# Altium schematic sheet encoder.SchDoc
size A4
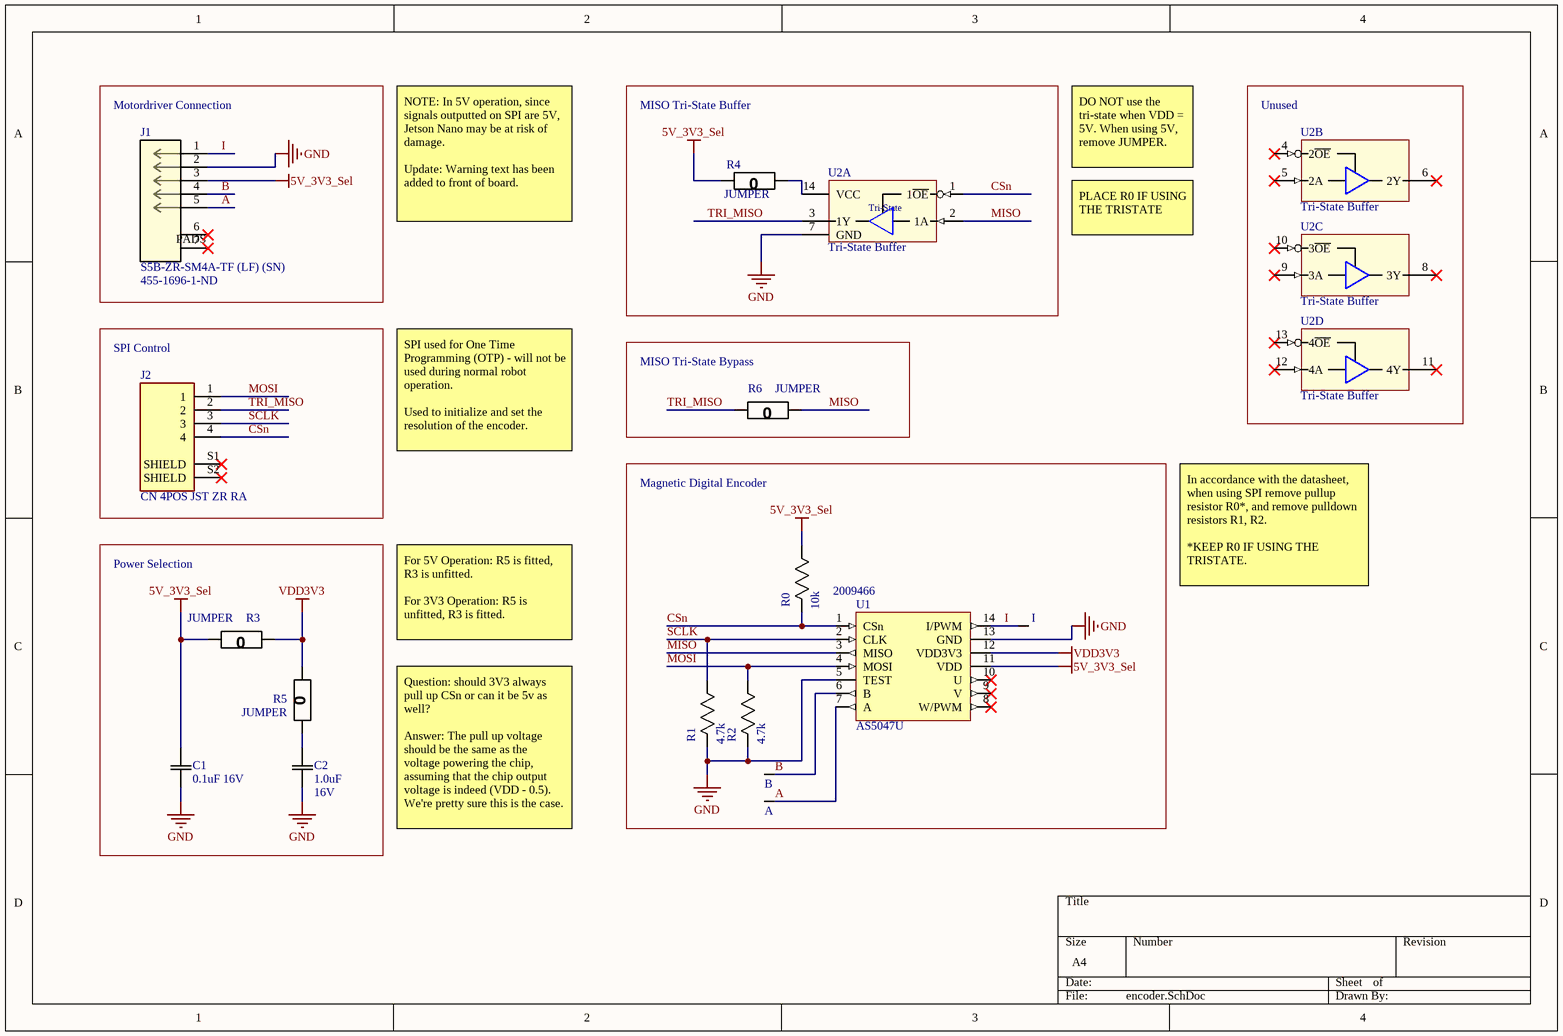
[diagram p0: encoder.SchDoc]

## Parts
A  Test Point (Via)  [TP]  (value not drawn)  (no BOM)
B  Test Point (Via)  [TP]  (value not drawn)  (no BOM)
C1  0.1uF 16V  [0603]
C2  value 1.0uF  Rating: 16V  [0603]  (hidden comment: 1.0uF 16V)
I  Test Point (Via)  [TP]  (value not drawn)  (no BOM)
J1  S5B-ZR-SM4A-TF (LF) (SN)  Supplier Part Number 1: 455-1696-1-ND  [JST_S5B-ZR-SM4A-TF]
J2  CN 4POS JST ZR RA  [JST_S4B-ZR-SM4A-TF(LF)(SN)]
R0  10k  [0603]
R1  4.7k  [0603]
R2  4.7k  [0603]
R3  JUMPER  [0603]
R4  JUMPER  [0603]
R5  JUMPER  [0603]
R6  JUMPER  [0603]
U1  AS5047U  Supplier Part Number 1: 2009466  [AS5047U]
U2  Tri-State Buffer  [14-TSSOP]  (parts A,B,C,D of 4)

## Blocks framed on the sheet
Motordriver Connection: J1
MISO Tri-State Buffer: R4 U2
Unused: U2
SPI Control: J2
MISO Tri-State Bypass: R6
Magnetic Digital Encoder: A B I R0-R2 U1
Power Selection: C1 C2 R3 R5

## Nets
5V_3V3_Sel: C1.1(C1) J1.3 R0.1(R1) R3.1(R1) R4.2(R2) U1.11(VDD)
GND: C1.2(C2) C2.2(C2) J1.2 R1.2(R2) R2.2(R2) U1.5(TEST) U1.13(GND) U2.7(GND)
VDD3V3: R3.2(R2) R5.1(R1) U1.12(VDD3V3)
A: A.1 J1.5 U1.7(A)
B: B.1 J1.4 U1.6(B)
CSn: J2.4 R0.2(R2) U1.1(CSn) U2.1(1~{OE})
I: I.1 J1.1 U1.14(I/PWM)
MISO: R6.1(R1) U1.3(MISO) U2.2(1A)
MOSI: J2.1 R2.1(R1) U1.4(MOSI)
SCLK: J2.3 R1.1(R1) U1.2(CLK)
TRI_MISO: J2.2 R6.2(R2) U2.3(1Y)
NetC2_1: C2.1(C1) R5.2(R2)
NetR4_1: R4.1(R1) U2.14(VCC)

Not connected (* = marked no-connect by the designer): J1 6* 7*; J2 S1(SHIELD)* S2(SHIELD)*; U1 8(W/PWM)* 9(V)* 10(U)*; U2 4(2~{OE})* 5(2A)* 6(2Y)* 8(3Y)* 9(3A)* 10(3~{OE})* 11(4Y)* 12(4A)* 13(4~{OE})*

## Notes on the sheet
- DO NOT use the tri-state when VDD = 5V. When using 5V, remove JUMPER.
- NOTE: In 5V operation, since signals outputted on SPI are 5V, Jetson Nano may be at risk of damage.
  Update: Warning text has been added to front of board.
- PLACE R0 IF USING THE TRISTATE
- SPI used for One Time Programming (OTP) - will not be used during normal robot operation.
  Used to initialize and set the resolution of the encoder.
- In accordance with the datasheet, when using SPI remove pullup resistor R0*, and remove pulldown resistors R1, R2.
  *KEEP R0 IF USING THE TRISTATE.
- For 5V Operation: R5 is fitted, R3 is unfitted.
  For 3V3 Operation: R5 is unfitted, R3 is fitted.
- Question: should 3V3 always pull up CSn or can it be 5v as well?
  Answer: The pull up voltage should be the same as the voltage powering the chip, assuming that the chip output voltage is indeed (VDD - 0.5). We're pretty sure this is the case.
- (in symbol CN 5POS JST ZR RA) PADS
- (in symbol SN74LVC125APWR, part A) Tri-State

## Library data of the parts
C1 = CAP 0.10uF 16V: Default Symbol for Capacitors; Value: 0.10uF; Temperature Coefficient: X5R; Tolerance: 10%; Part Number: CAP 0.10uF 16V; Rating: 16V
C2 = CAP 1.0uF 16V: Default Symbol for Capacitors; Tolerance: 10%; Temperature Coefficient: X5R; Part Number: CAP 1.0uF 16V
J1 = CN 5POS JST ZR RA: Connector Header Surface Mount, Right Angle 5 position 0.059" (1.50mm); Supplier 1: Digi-Key; Part Number: CN 5POS JST ZR RA; Manufacturer Part Number 1: S5B-ZR-SM4A-TF; Supplier URL 1: https://www.digikey.ca/en/products/detail/jst-sales-america-inc/S5B-ZR-SM4A-TF-LF-SN/926603?s=N4IgTCBcDaICwFYEFoCMA2AnOtyByAIiALoC%2BQA; Pin Count: 5
J2 = CN 4POS JST ZR RA: Connector Header Surface Mount, Right Angle 4 position 0.059 (1.50mm); MF: JST Sales; MP: S4B-ZR-SM4A-TF(LF)(SN); SnapEDA_Link: https://www.snapeda.com/parts/S4B-ZR-SM4A-TF(LF)(SN)/JST%20Sales%20America%20Inc./view-part/449060/?ref=snap; Availability: Unavailable; Value: *; Price: None; Arrow_Electronics-Purchase-URL: https://snapeda.com/shop?store=Arrow+Electronics&id=449060; Package: None; Part Number: CN 4POS JST ZR RA; Supplier 1: Digi-Key; Supplier Part Number 1: 455-1695-1-ND; Supplier URL 1: https://www.digikey.ca/en/products/detail/jst-sales-america-inc/S4B-ZR-SM4A-TF-LF-SN/926602?s=N4IgTCBcDaIMoBYBCBaAWgJRXAsgggigCoBiAFADIkCUZcActSALoC%2BQA; Pin Count: 4
R0 = RES 10k 1/8W - 1%: Default Resistor Symbol; Manufacturer Part Number 1: ERJ-H3GJ103V; Power (Watts): 0.125W; Tolerance: 5%; Package: 0805; Value: 10k; Part Number: RES 10k 1/8W - 1%; Supplier 1: Digi-Key; Supplier Part Number 1: 10-ERJ-H3GJ103VCT-ND; Supplier URL 1: https://www.digikey.ca/en/products/detail/panasonic-electronic-components/ERJ-H3GJ103V/13877876?s=N4IgTCBcDaIIwAYC0BRASgKSQCQMwHENFcA1AYQBUkA5AERAF0BfIA; Manufacturer Part Number 2: RMCF0805JT10K0; Supplier 2: Digi-Key; Supplier Part Number 2: RMCF0805JT10K0CT-ND; Supplier URL 2: https://www.digikey.ca/en/products/detail/stackpole-electronics-inc/RMCF0805JT10K0/1757762?s=N4IgTCBcDaIEoFkDCAxADADjQVgFIBUBGNAaTSXxAF0BfIA; Tolerance 2: 5%
R1 R2 = RES 4.7k 1/8W - 1%: Default Resistor Symbol; Manufacturer Part Number 1: RMCF0603FT4K70; Power (Watts): 0.125W; Tolerance: 1%; Package: 0805; Value: 4.7k; Part Number: RES 4.7k 1/8W - 1%; Supplier 1: Digi-Key; Supplier Part Number 1: RMCF0603FT4K70CT-ND; Supplier URL 1: https://www.digikey.ca/en/products/detail/stackpole-electronics-inc/RMCF0603FT4K70/1760998
R3-R6 = RES 0 JUMPER: RES SMD 0 OHM JUMPER GENERIC 0805; Manufacturer Part Number 1: RK73Z1JTTD; Value: 0; Package: 0805; Part Number: RES 0 JUMPER; Tolerance: N/A; Supplier 1: Digi-Key; Supplier Part Number 1: 2019-RK73Z1JTTDCT-ND; Supplier URL 1: https://www.digikey.ca/en/products/detail/koa-speer-electronics-inc/RK73Z1JTTD/9845478
U1 = AS5047U: 14-Bit On-Axis Magnetic Rotary Position Sensor with Up to 14-Bit Binary Incremental Pulse Count; Supplier 1: RSComponents
U2 = SN74LVC125APWR: Buffer, Non-Inverting 4 Element 1 Bit per Element 3-State Output 14-TSSOP; Part Number: SN74LVC125APWR; Manufacturer Part Number 1: SN74LVC125APWR; Supplier 1: Digi-Key; Supplier Part Number 1: 296-1222-1-ND; Supplier URL 1: https://www.digikey.ca/en/products/detail/texas-instruments/SN74LVC125APWR/276865
A B I = Test Point (Via): Part Number: Test Point (Via)